# EAGLE schematic variable_supply_module_v1 (EAGLE 6.5.0)
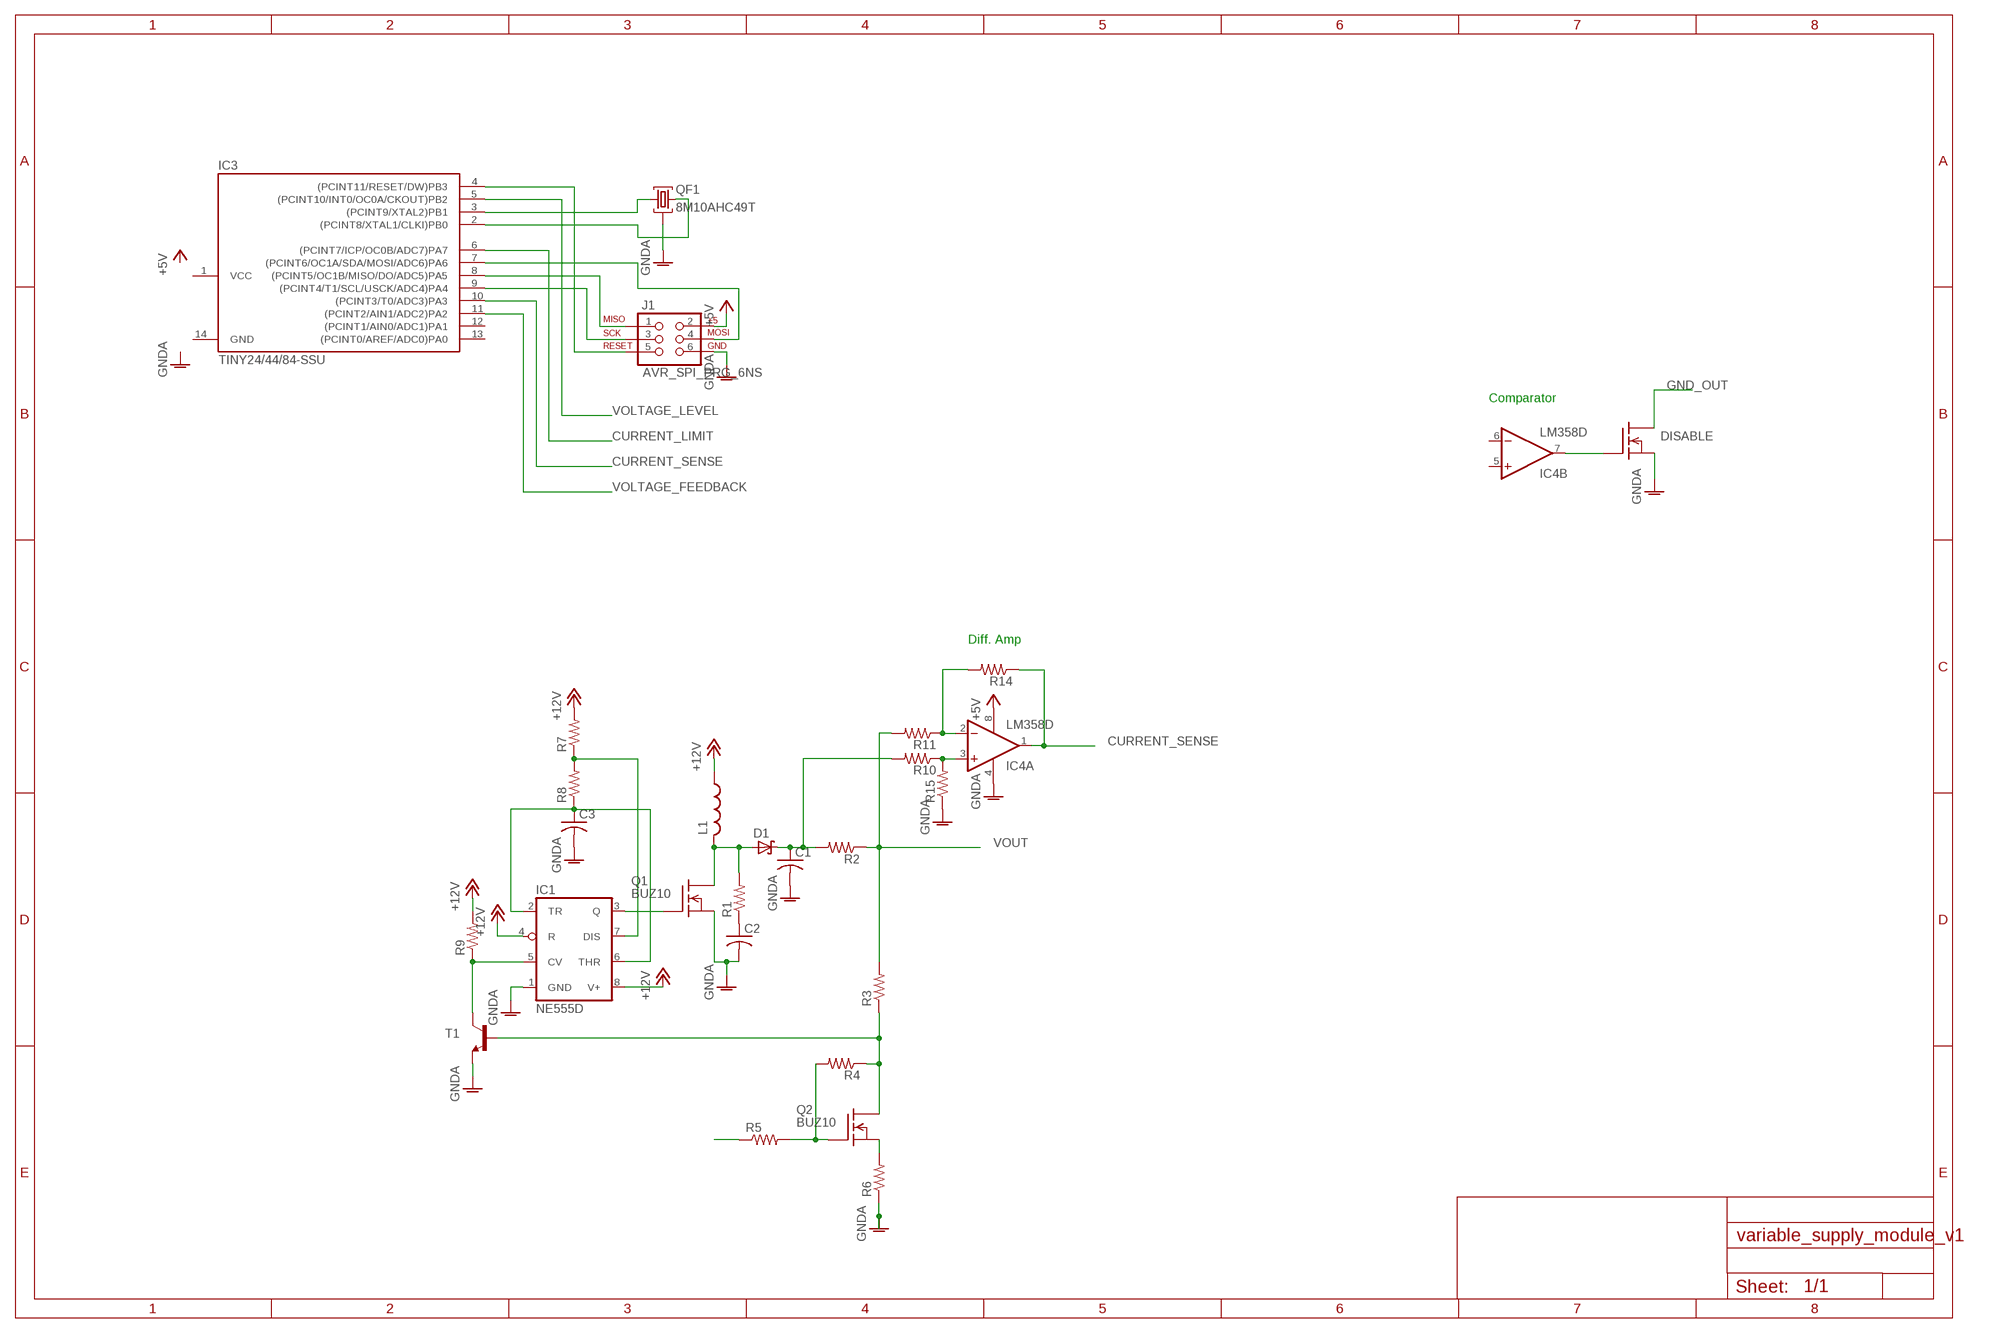
[diagram p0: schematic, sheet 1]

## Parts
C1  C-USC0805K  [C0805K]
C2  C-USC0805K  [C0805K]
C3  C-USC0805K  [C0805K]
D1  SCHOTTKY-DIODESMC  [SMC]
DISABLE  BUZ10  [TO220]
IC1  NE555D  [SO08]
IC3  TINY24/44/84-SSU  [SOIC14]
IC4  LM358D  [SO08]
J1  AVR_SPI_PRG_6NS  [2X3-NS]
L1  L-USTJ3-U2  [TJ3-U2]
Q1  BUZ10  [TO220]
Q2  BUZ10  [TO220]
QF1  8M10AHC49T  [HC49U]
R1  R-US_M0805  [M0805]
R2  R-US_M0805  [M0805]
R3  R-US_M0805  [M0805]
R4  R-US_M0805  [M0805]
R5  R-US_M0805  [M0805]
R6  R-US_M0805  [M0805]
R7  R-US_M0805  [M0805]
R8  R-US_M0805  [M0805]
R9  R-US_M0805  [M0805]
R10  R-US_M0805  [M0805]
R11  R-US_M0805  [M0805]
R14  R-US_M0805  [M0805]
R15  R-US_M0805  [M0805]
T1  2N2222-NPN-TO92-EBC  [TO92-EBC]

## Nets
+5V: IC4.8(P:V+) J1.2
+12V: IC1.4(R) IC1.8(V+) L1.1 R7.2 R9.2
CURRENT_LIMIT: IC3.6((PCINT7/ICP/OC0B/ADC7)PA7)
CURRENT_SENSE: IC3.10((PCINT3/T0/ADC3)PA3) IC4.1(A:OUT) R14.1
GND_OUT: DISABLE.2(D)
GNDA: C1.2 C2.2 C3.2 DISABLE.3(S) IC1.1(GND) IC4.4(P:V-) J1.6 Q1.3(S) QF1.2 R15.1 T1.E
N$1: D1.A L1.2 Q1.2(D) R1.2
N$2: C1.1 D1.C R2.2 R10.2
N$3: C2.1 R1.1
N$4: Q2.2(D) R3.1 R4.1 T1.B
N$5: Q2.1(G) R4.2 R5.2
N$6: R5.1
N$7: IC4.2(A:-IN) R11.1 R14.2
N$8: Q2.3(S) R6.2
N$9: R6.1 ; supply symbol labelled GNDA
N$10: IC1.3(Q) Q1.1(G)
N$11: IC1.7(DIS) R7.1 R8.2
N$12: C3.1 IC1.2(TR) IC1.6(THR) R8.1
N$13: IC1.5(CV) R9.1 T1.C
N$14: IC4.3(A:+IN) R10.1 R15.2
N$15: DISABLE.1(G) IC4.7(B:OUT)
N$16: IC3.3((PCINT9/XTAL2)PB1) QF1.1
N$17: IC3.2((PCINT8/XTAL1/CLKI)PB0) QF1.3
N$18: IC3.7((PCINT6/OC1A/SDA/MOSI/ADC6)PA6) J1.4
N$19: IC3.8((PCINT5/OC1B/MISO/DO/ADC5)PA5) J1.1
N$20: IC3.9((PCINT4/T1/SCL/USCK/ADC4)PA4) J1.3
N$21: IC3.4((PCINT11/RESET/DW)PB3) J1.5
VOLTAGE_FEEDBACK: IC3.11((PCINT2/AIN1/ADC2)PA2)
VOLTAGE_LEVEL: IC3.5((PCINT10/INT0/OC0A/CKOUT)PB2)
VOUT: R2.1 R3.2 R11.2
Unconnected: IC3.12((PCINT1/AIN0/ADC1)PA1) IC3.13((PCINT0/AREF/ADC0)PA0) IC4.5(B:+IN) IC4.6(B:-IN)

## Notes on the sheet
- Comparator
- Diff. Amp

## Power pins joined to a net without a drawn wire
GND: IC3.14(GND)
VCC: IC3.1(VCC)

## Library data of the parts
C1-C3 = rcl:C-US: CAPACITOR, American symbol
D1 = diode:SCHOTTKY-DIODE: Schottky Diode
DISABLE Q1 Q2 = transistor-fet:BUZ10: N-Channel Enhancement MOSFET 50V; 20A; 0,080Ohm
IC1 = linear:*555: TIMER
IC3 = avr-7:TINY24/44/84
IC4 = linear:LM358: OP AMP also LM158; LM258; LM2904 Source: http://cache.national.com/ds/LM/LM158.pdf
J1 = SparkFun-Connectors:AVR_SPI_PRG_6: AVR ISP 6 Pin This is the reduced ISP connector for AVR programming. Common on Arduino. This footprint will take up less PCB space and can be used with a 10-pin to 6-pin adapter such as SKU: BOB-08508
L1 = rcl:L-US: INDUCTOR, American symbol
QF1 = crystal:8M10AHC49T: Monolithic Crystal Filters Source: www.vanlong.com; OC_FARNELL: unknown; OC_NEWARK: unknown
R1-R11 R14 R15 = rcl:R-US_: RESISTOR, American symbol
T1 = transistor-neu-to92:*-NPN-: NPN Transistror